# Altium schematic sheet Sheet1.SchDoc
size A3; SheetNumber: 1; SheetTotal: 1
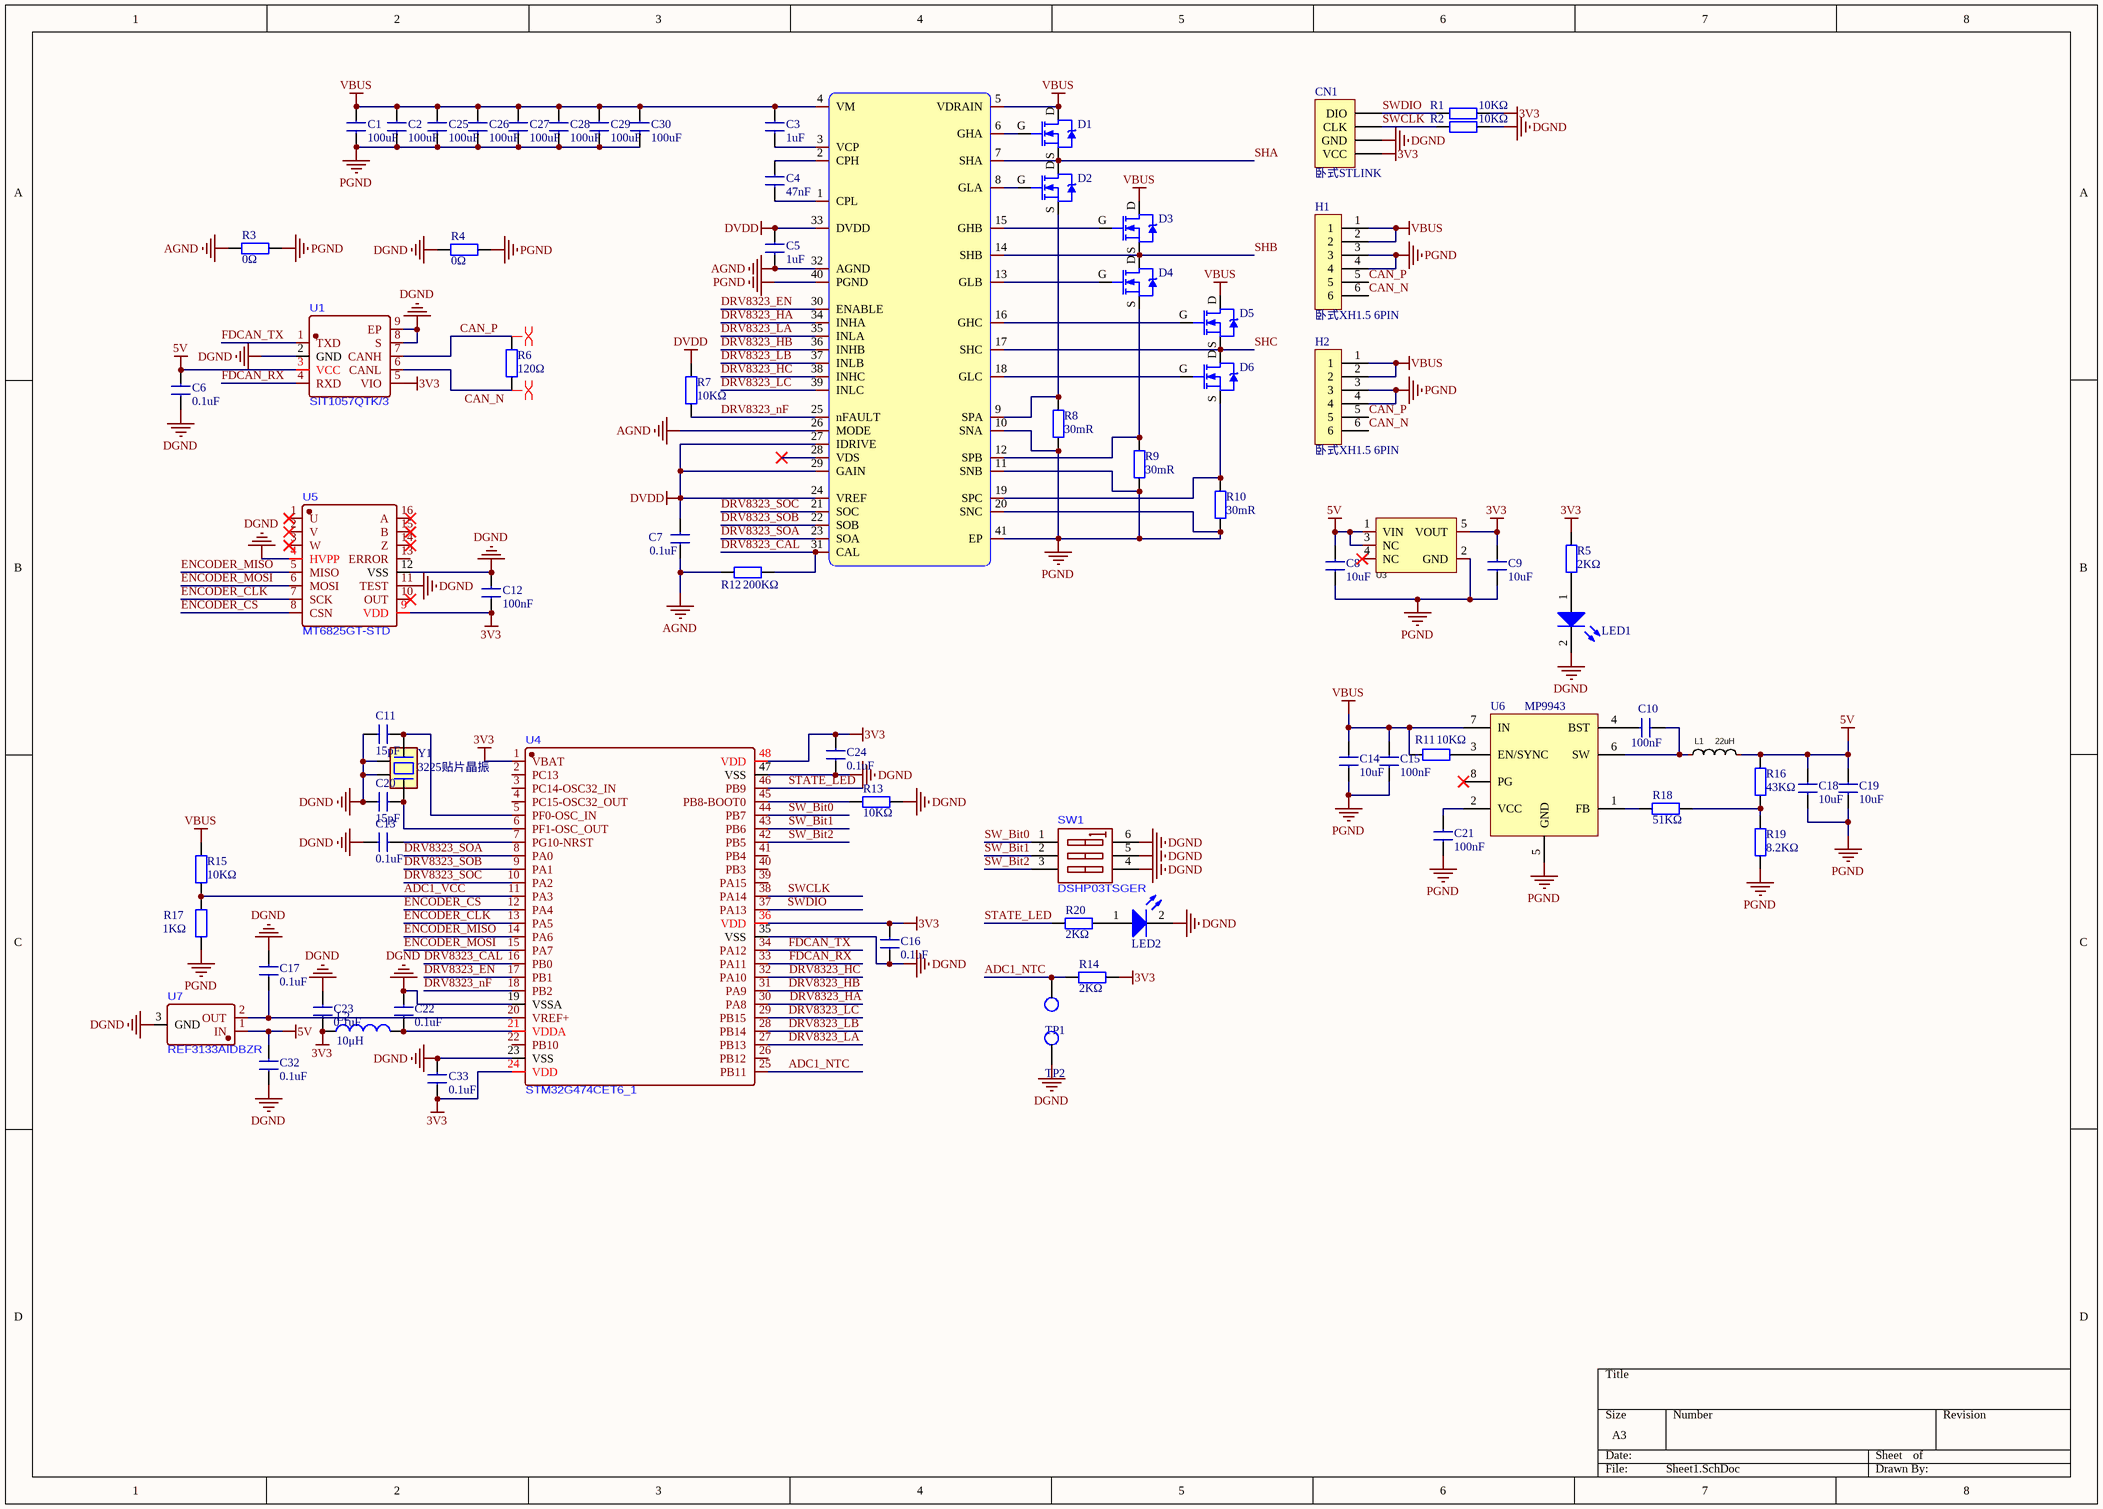
[diagram p0: Sheet1.SchDoc]

## Parts
C1  100uF  [1206]
C2  100uF  [1206]
C3  1uF  [c0402]
C4  47nF  [c0402]
C5  1uF  [c0402]
C6  0.1uF  [c0402]
C7  0.1uF  [c0402]
C8  10uF  [c0402]
C9  10uF  [c0402]
C10  100nF  [c0402]
C11  15pF  [c0402]
C12  100nF  [C0402]
C13  0.1uF  [c0402]
C14  10uF  [C0603]
C15  100nF  [c0402]
C16  0.1uF  [c0402]
C17  0.1uF  [c0402]
C18  10uF  [C0603]
C19  10uF  [C0603]
C20  15pF  [c0402]
C21  100nF  [c0402]
C22  0.1uF  [c0402]
C23  0.1uF  [c0402]
C24  0.1uF  [c0402]
C25  100uF  [1206]
C26  100uF  [1206]
C27  100uF  [1206]
C28  100uF  [1206]
C29  100uF  [1206]
C30  100uF  [1206]
C32  0.1uF  [c0402]
C33  0.1uF  [c0402]
CN1  卧式STLINK  [CONN-SMD_4P-P1.25_GH1.25-4P]
D1  NTMFS5C410NL  [DFN-8_L3.0-W3.0-P0.65-BL]  (value not drawn)
D2  NTMFS5C410NL  [DFN-8_L3.0-W3.0-P0.65-BL]  (value not drawn)
D3  NTMFS5C410NL  [DFN-8_L3.0-W3.0-P0.65-BL]  (value not drawn)
D4  NTMFS5C410NL  [DFN-8_L3.0-W3.0-P0.65-BL]  (value not drawn)
D5  NTMFS5C410NL  [DFN-8_L3.0-W3.0-P0.65-BL]  (value not drawn)
D6  NTMFS5C410NL  [DFN-8_L3.0-W3.0-P0.65-BL]  (value not drawn)
H1  卧式XH1.5 6PIN  [CONN-SMD_6P-P1.50_ZX-ZH1.5-6PWT]
H2  卧式XH1.5 6PIN  [CONN-SMD_6P-P1.50_ZX-ZH1.5-6PWT]
L1  22uH  [IND-SMD_L2.5-W2.0]
L2  10μH  [L0805]
LED1  LED  [led0805]  (value not drawn)
LED2  LED  [led0805]  (value not drawn)
R1  10KΩ  [R0402]
R2  10KΩ  [R0402]
R3  0Ω  [R0402]
R4  0Ω  [R0402]
R5  2KΩ  [R0402]
R6  120Ω  [R0402]
R7  10KΩ  [R0402]
R8  30mR  [1206]
R9  30mR  [1206]
R10  30mR  [1206]
R11  10KΩ  [R0402]
R12  200KΩ  [R0402]
R13  10KΩ  [R0402]
R14  2KΩ  [R0402]
R15  10KΩ  [R0402]
R16  43KΩ  [R0402]
R17  1KΩ  [R0402]
R18  51KΩ  [R0402]
R19  8.2KΩ  [R0402]
R20  2KΩ  [R0402]
SW1  DSHP03TSGER  [SW-SMD_6P-L5.4-W5.4-P1.27-LS8.4]
TP1  testpoint  [testpoint]  (value not drawn)
TP2  testpoint  [testpoint]  (value not drawn)
U1  SIT1057QTK/3  [DFN-8_L3.0-W3.0-P0.65-BL-EP]
U2  DRV8323HRTAR  [QFN-40_L6.0-W6.0-P0.50-BL-EP4.5]  (value not drawn)
U3  XC6201P332MR-HXY  [SOT-23-5_L3.0-W1.7-P0.95-LS2.8-BR]  (value not drawn)
U4  STM32G474CET6_1  [LQFP-48_L7.0-W7.0-P0.50-LS9.0-BL]
U5  MT6825GT-STD  [TSSOP-16_L5.0-W4.4-P0.65-LS6.4-BL-1]
U6  MP9943  [QFN-8 3x3]
U7  REF3133AIDBZR  [SOT-23-3_L2.9-W1.3-P1.90-LS2.4-BR]
Y1  3225贴片晶振  [OSC-3225-4P]

## Nets
3V3: C9.2 C12.1 C16.1 C23.2 C24.1 C33.2 CN1.1(VCC) L2.1 R1.2 R5.1 R14.2 U1.5(VIO) U3.5(VOUT) U4.1(VBAT) U4.24(VDD) U4.36(VDD) U4.48(VDD) U5.9(VDD)
5V: C6.2 C8.2 C18.2 C19.2 C32.1 L1.2 R16.2 U1.3(VCC) U3.1(VIN) U3.3(NC) U7.1(IN)
AGND: C5.1 C7.1 R3.1 R12.2 U2.26(MODE) U2.32(AGND)
DGND: C6.1 C11.2 C12.2 C13.2 C16.2 C17.2 C20.2 C22.1 C23.1 C24.2 C32.2 C33.1 CN1.2(GND) LED1.2(K) LED2.2(K) R2.2 R4.1 R13.2 SW1.4(B3) SW1.5(B2) SW1.6(B1) TP2.1 U1.2(GND) U1.8(S) U1.9(EP) U4.19(VSSA) U4.23(VSS) U4.35(VSS) U4.47(VSS) U5.4(HVPP) U5.11(TEST) U5.12(VSS) U7.3(GND) Y1.2 Y1.4
DVDD: C5.2 C7.2 R7.1 U2.24(VREF) U2.27(IDRIVE) U2.29(GAIN) U2.33(DVDD)
PGND: C1.1 C2.1 C8.1 C9.1 C14.1 C15.1 C18.1 C19.1 C21.1 C25.1 C26.1 C27.1 C28.1 C29.1 C30.1 H1.3 H1.4 H2.3 H2.4 R3.2 R4.2 R8.1 R9.1 R10.1 R17.2 R19.1 U2.10(SNA) U2.11(SNB) U2.20(SNC) U2.40(PGND) U2.41(EP) U3.2(GND) U6.5(GND)
VBUS: C1.2 C2.2 C3.2 C14.2 C15.2 C25.2 C26.2 C27.2 C28.2 C29.2 C30.2 D1.D D3.D D5.D H1.1 H1.2 H2.1 H2.2 R11.1 R15.2 U2.4(VM) U2.5(VDRAIN) U6.7(IN)
ADC1_NTC: R14.1 TP1.1 U4.25(PB11)
ADC1_VCC: R15.1 R17.1 U4.11(PA3)
CAN_N: H1.6 H2.6 R6.1 U1.6(CANL)
CAN_P: H1.5 H2.5 R6.2 U1.7(CANH)
DRV8323_CAL: R12.1 U2.31(CAL) U4.16(PB0)
DRV8323_EN: U2.30(ENABLE) U4.17(PB1)
DRV8323_HA: U2.34(INHA) U4.30(PA8)
DRV8323_HB: U2.36(INHB) U4.31(PA9)
DRV8323_HC: U2.38(INHC) U4.32(PA10)
DRV8323_LA: U2.35(INLA) U4.27(PB13)
DRV8323_LB: U2.37(INLB) U4.28(PB14)
DRV8323_LC: U2.39(INLC) U4.29(PB15)
DRV8323_nF: R7.2 U2.25(nFAULT) U4.18(PB2)
DRV8323_SOA: U2.23(SOA) U4.8(PA0)
DRV8323_SOB: U2.22(SOB) U4.9(PA1)
DRV8323_SOC: U2.21(SOC) U4.10(PA2)
ENCODER_CLK: U4.13(PA5) U5.7(SCK)
ENCODER_CS: U4.12(PA4) U5.8(CSN)
ENCODER_MISO: U4.14(PA6) U5.5(MISO)
ENCODER_MOSI: U4.15(PA7) U5.6(MOSI)
FDCAN_RX: U1.4(RXD) U4.33(PA11)
FDCAN_TX: U1.1(TXD) U4.34(PA12)
SHA: D1.S D2.D U2.7(SHA)
SHB: D3.S D4.D U2.14(SHB)
SHC: D5.S D6.D U2.17(SHC)
STATE_LED: R20.1 U4.46(PB9)
SW_Bit0: SW1.1(A1) U4.44(PB7)
SW_Bit1: SW1.2(A2) U4.43(PB6)
SW_Bit2: SW1.3(A3) U4.42(PB5)
SWCLK: CN1.3(CLK) R2.1 U4.38(PA14)
SWDIO: CN1.4(DIO) R1.1 U4.37(PA13)
NetC3_1: C3.1 U2.3(VCP)
NetC4_1: C4.1 U2.1(CPL)
NetC4_2: C4.2 U2.2(CPH)
NetC10_1: C10.1 U6.4(BST)
NetC10_2: C10.2 L1.1 U6.6(SW)
NetC11_1: C11.1 U4.5(PF0-OSC_IN) Y1.3
NetC13_1: C13.1 U4.7(PG10-NRST)
NetC17_1: C17.1 U4.20(VREF+) U7.2(OUT)
NetC20_1: C20.1 U4.6(PF1-OSC_OUT) Y1.1
NetC21_2: C21.2 U6.2(VCC)
NetC22_2: C22.2 L2.2 U4.21(VDDA)
NetD1_G: D1.G U2.6(GHA)
NetD2_G: D2.G U2.8(GLA)
NetD2_S: D2.S R8.2 U2.9(SPA)
NetD3_G: D3.G U2.15(GHB)
NetD4_G: D4.G U2.13(GLB)
NetD4_S: D4.S R9.2 U2.12(SPB)
NetD5_G: D5.G U2.16(GHC)
NetD6_G: D6.G U2.18(GLC)
NetD6_S: D6.S R10.2 U2.19(SPC)
NetLED1_1: LED1.1(A) R5.2
NetLED2_1: LED2.1(A) R20.2
NetR11_2: R11.2 U6.3(EN/SYNC)
NetR13_1: R13.1 U4.45(PB8-BOOT0)
NetR16_1: R16.1 R18.2 R19.2
NetR18_1: R18.1 U6.1(FB)

Not connected (* = marked no-connect by the designer): U2 28(VDS)*; U3 4(NC)*; U4 2(PC13) 3(PC14-OSC32_IN) 4(PC15-OSC32_OUT) 22(PB10) 26(PB12) 39(PA15) 40(PB3) 41(PB4); U5 1(U)* 2(V)* 3(W)* 10(OUT)* 13(ERROR) 14(Z)* 15(B)* 16(A)*; U6 8(PG)*

## Layout directives
differential pair: CAN_N, CAN_P

## Library data of the parts
C1 C2 C14 C18 C19 C25-C30 = 1210贴片电容
C3-C13 C15-C17 C20-C24 C32 C33 = 0402贴片电容: 贴片电容0402
D1-D6 = NTMFS5C410NL: N沟道MOS管; Note: Pin 2 is electrically connected to pin 4.; Published: 8-Jun-2000; LatestRevisionDate: 17-Jul-2002; LatestRevisionNote: Re-released for DXP Platform.; DatasheetVersion: PD-9.814; PackageVersion: Feb-1997; PackageReference: TO-220AB; Publisher: Altium Limited; PackageDescription: TO, Thru-Hole, Vertical, Heatsink Mounted; 3 In-Line Leads; Pitch 2.54 mm; ComponentLink1Description: Manufacturer Link; ComponentLink1URL: http://www.irf.com/
L1 = 0530屏蔽电感: 一体成型屏蔽电感，0530封装，额定电流3A; Manufacturer: XR(祥如); Symbol: XR0530-100M; Add into BOM: yes; Value: 10uH; Tolerance: ±20%; Rated Current: 3.2A; Saturation Current (Isat): 3.5A; DC Resistance (DCR): 125mΩ; Type: 一体成型电感; Device: XR0530-100M; LCSC Part Name: 10uH ±20% 3.5A; Supplier Part: C5307602; Manufacturer Part: XR0530-100M; Supplier Footprint: SMD,0530; JLCPCB Part Class: Extended Part; Datasheet: https://atta.szlcsc.com/upload/public/pdf/source/20240328/42FE63A3232C4AF7EB8F1CDEDD5FC69F.pdf; Supplier: LCSC; Convert to PCB: yes
L2 = 0805贴片电感
LED1 LED2 = 0805贴片LED
R1-R7 R11-R20 = 0402贴片电阻: W: *
R8-R10 = 2512检流电阻
U2 = DRV8323HRTAR: Manufacturer: TI(德州仪器); Add into BOM: yes; Symbol: DRV8323HRTAR; Device: DRV8323HRTAR; LCSC Part Name: 5mA 无刷直流BLDC电机驱动芯片 60V; Supplier Part: C701783; Manufacturer Part: DRV8323HRTAR; Supplier Footprint: QFN-40-EP(6x6); JLCPCB Part Class: Extended Part; Datasheet: https://www.ti.com/cn/lit/gpn/drv8323; Supplier: LCSC; Convert to PCB: yes
U3 = XC6201P332MR-HXY: 3.3V LDO; Manufacturer: HXY MOSFET(华轩阳电子); Add into BOM: yes; Output Type: 固定; Maximum Input Voltage: 12V; MAX Output Current: 300mA; Output Polarity: 正极; Symbol: XC6201P332MR-HXY; Device: XC6201P332MR-HXY; LCSC Part Name: XC6201P332MR-HXY; Supplier Part: C19626990; Manufacturer Part: XC6201P332MR-HXY; Supplier Footprint: SOT-23-5L; JLCPCB Part Class: Extended Part; Datasheet: https://atta.szlcsc.com/upload/public/pdf/source/20231208/3D7EFECB06481ED5AED4680614D7FFF5.pdf; Supplier: LCSC; Convert to PCB: yes; Output Voltage: 3.3V
U5 = MT6825GT-STD: 18位绝对角编码器
Y1 = 3225贴片晶振: Value: 16M